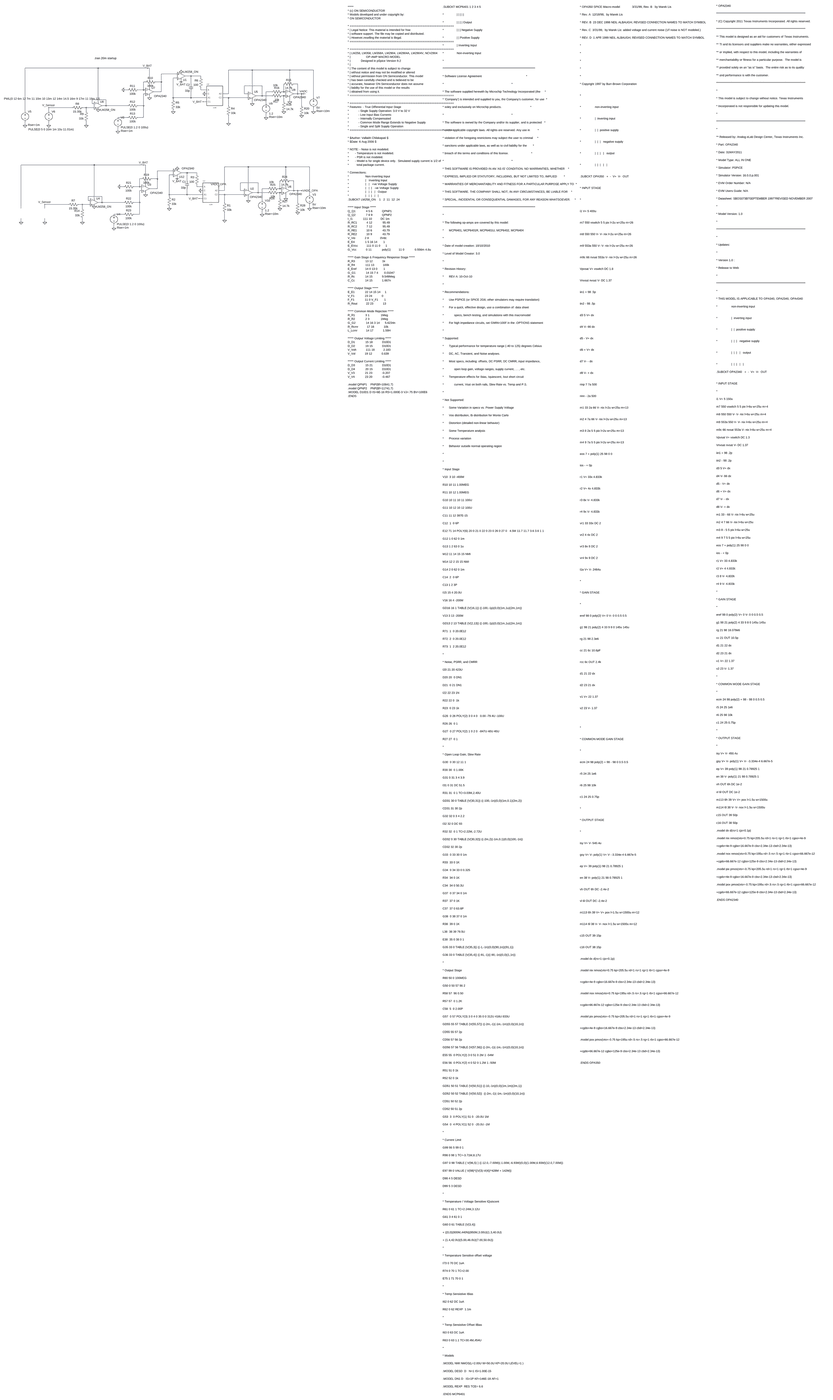
[diagram p0: schematic IL300_F-107_fuck.asc, whole sheet]
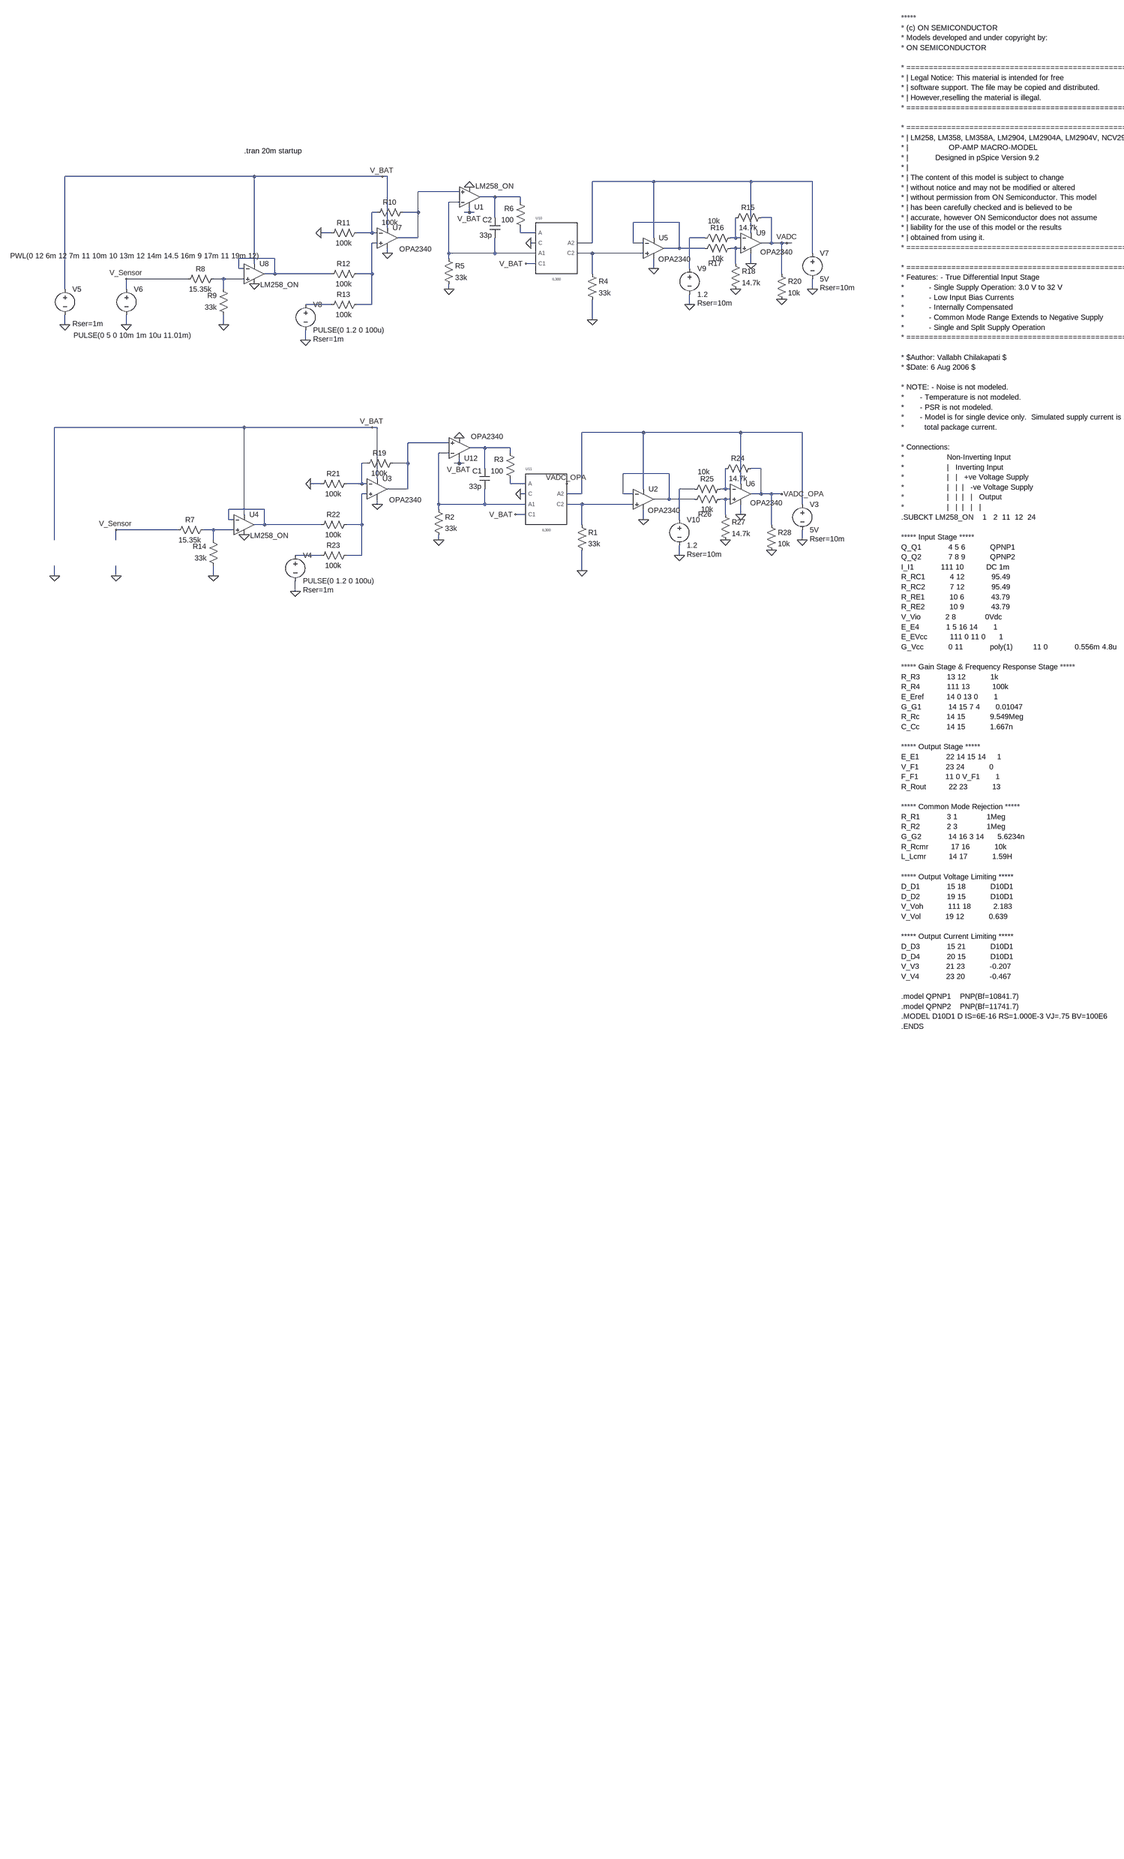
[diagram p1: schematic IL300_F-107_fuck.asc, part, row 1 of 2, column 1 of 2]
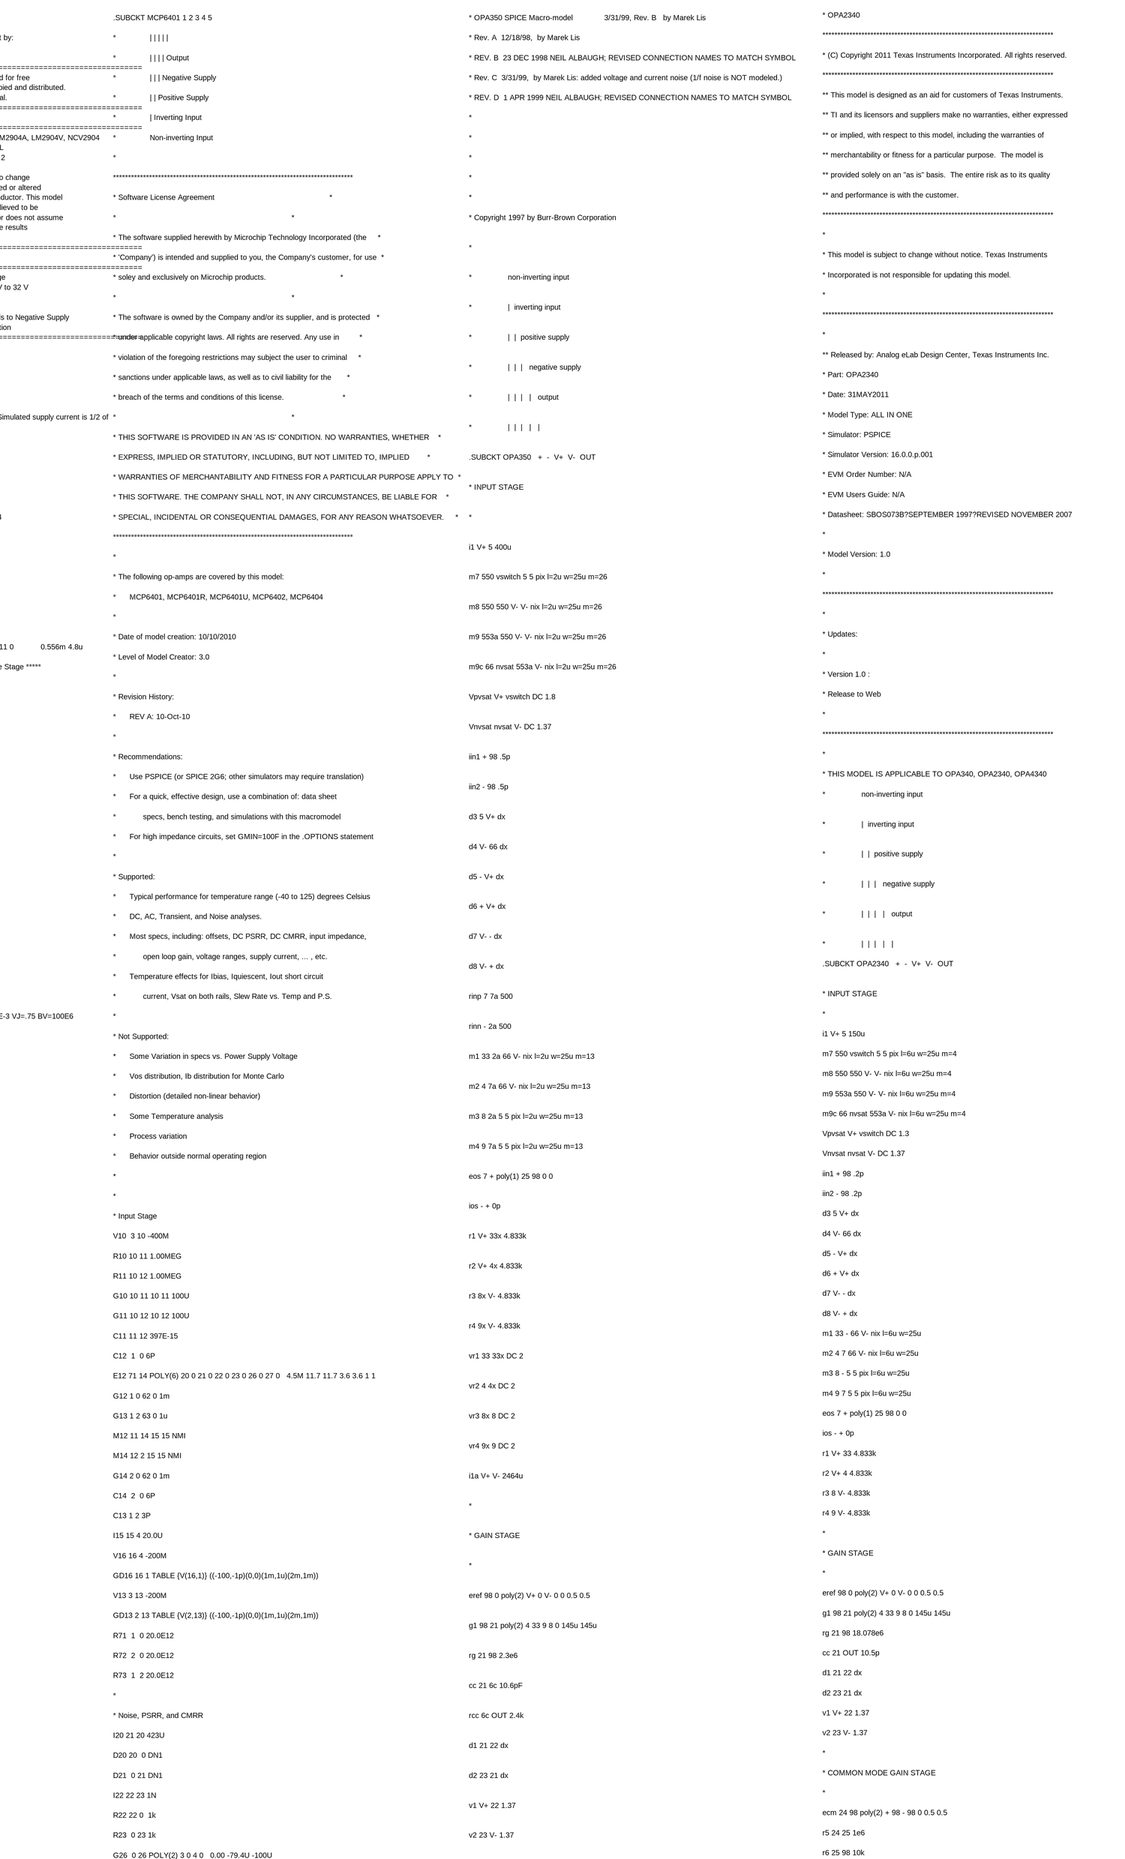
[diagram p2: schematic IL300_F-107_fuck.asc, part, row 1 of 2, column 2 of 2]
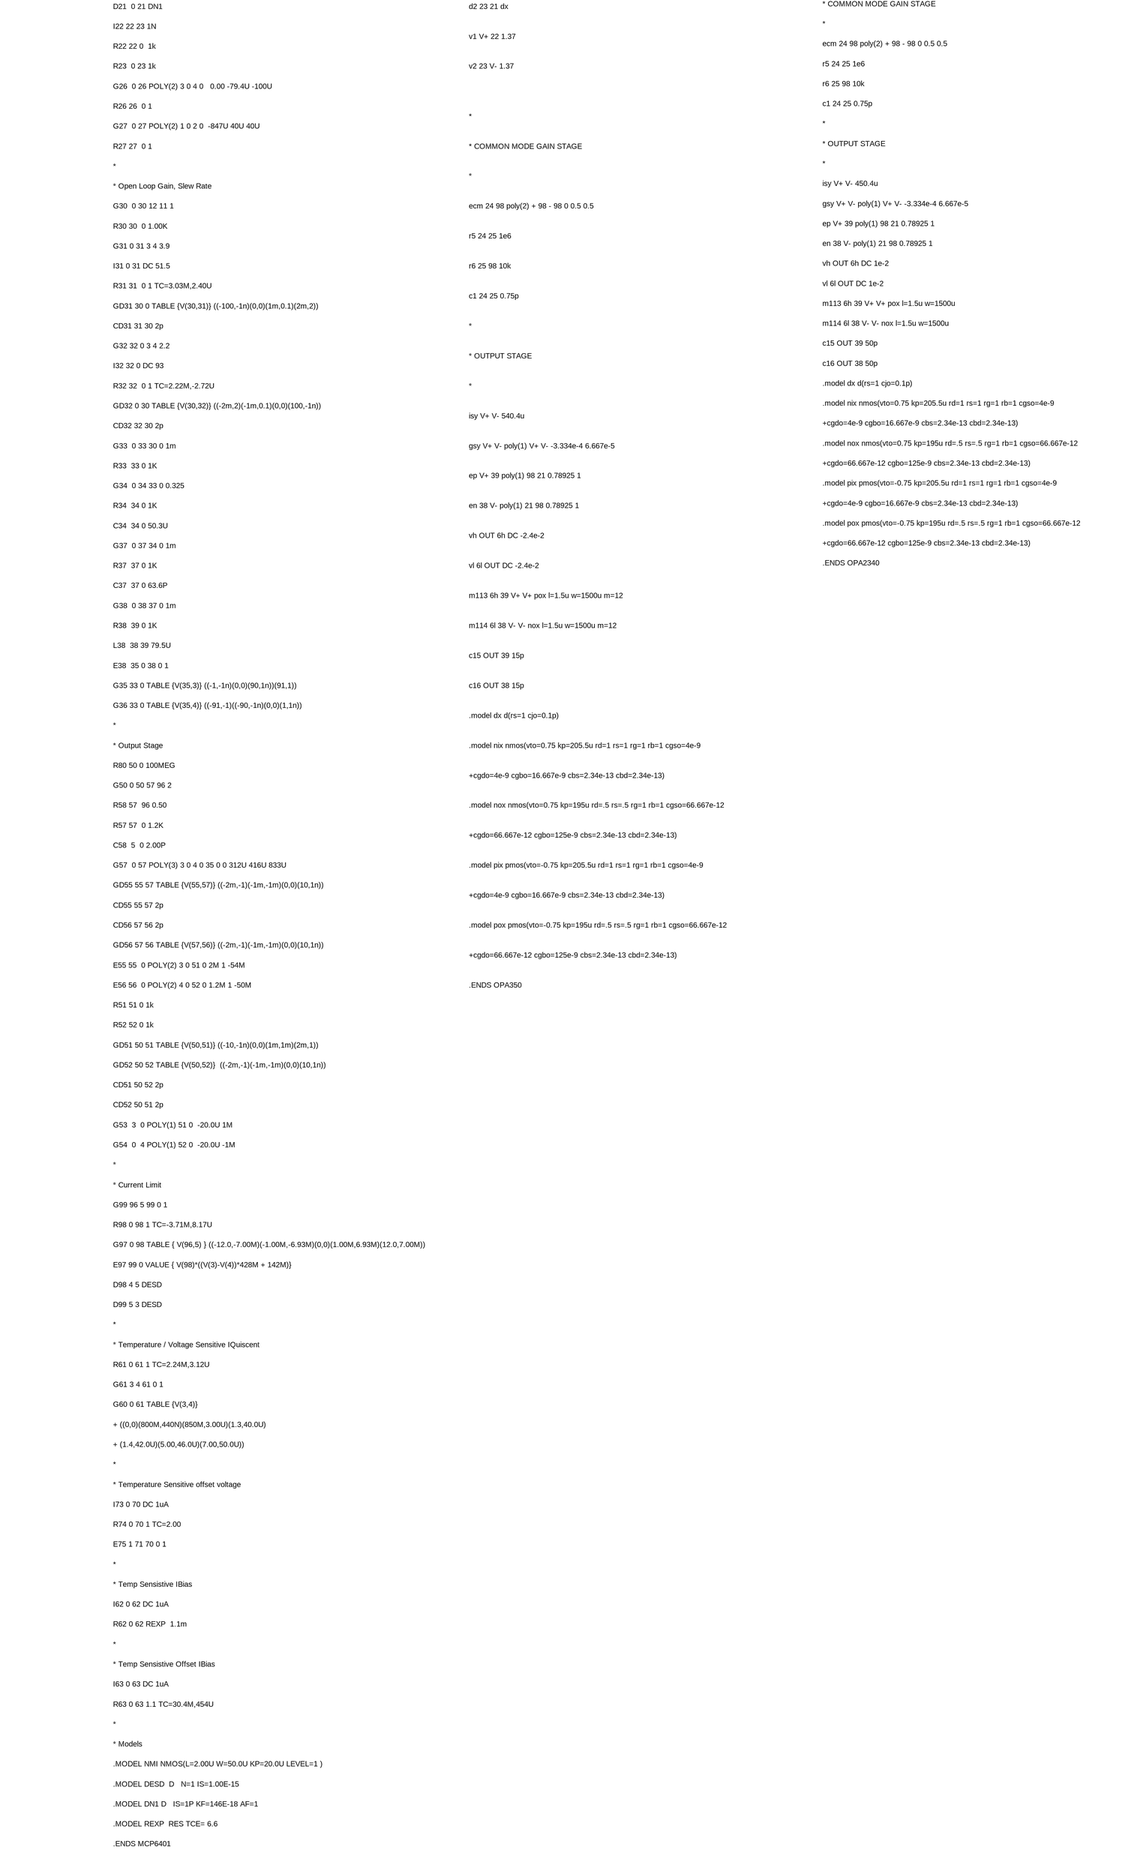
[diagram p3: schematic IL300_F-107_fuck.asc, part, row 2 of 2, column 2 of 2]
IL300_F-107_fuck.asc, the LTspice schematic file:
Version 4
SHEET 1 6832 5392
WIRE -976 -960 -1568 -960
WIRE -576 -960 -976 -960
WIRE -560 -960 -576 -960
WIRE 272 -944 80 -944
WIRE 576 -944 272 -944
WIRE 768 -944 576 -944
WIRE -336 -912 -464 -912
WIRE -224 -896 -272 -896
WIRE -144 -896 -224 -896
WIRE -336 -880 -368 -880
WIRE -144 -880 -144 -896
WIRE -592 -848 -608 -848
WIRE -464 -848 -464 -912
WIRE -464 -848 -512 -848
WIRE -304 -848 -304 -864
WIRE -304 -848 -320 -848
WIRE -288 -848 -304 -848
WIRE -224 -832 -224 -896
WIRE 640 -832 608 -832
WIRE 352 -816 208 -816
WIRE -560 -800 -560 -960
WIRE -736 -784 -768 -784
WIRE -608 -784 -608 -848
WIRE -608 -784 -656 -784
WIRE -592 -784 -608 -784
WIRE -144 -784 -144 -800
WIRE -96 -784 -144 -784
WIRE 576 -784 576 -944
WIRE -464 -768 -464 -848
WIRE -464 -768 -528 -768
WIRE 272 -768 272 -944
WIRE 432 -768 384 -768
WIRE 528 -768 528 -832
WIRE 528 -768 512 -768
WIRE 544 -768 528 -768
WIRE -592 -752 -608 -752
WIRE -96 -752 -112 -752
WIRE 80 -752 80 -944
WIRE 80 -752 32 -752
WIRE 208 -752 208 -816
WIRE 240 -752 208 -752
WIRE 640 -752 640 -832
WIRE 640 -752 608 -752
WIRE 672 -752 640 -752
WIRE 688 -752 672 -752
WIRE 704 -752 688 -752
WIRE 352 -736 352 -816
WIRE 352 -736 304 -736
WIRE 432 -736 352 -736
WIRE 528 -736 512 -736
WIRE 544 -736 528 -736
WIRE -560 -720 -560 -736
WIRE -368 -720 -368 -880
WIRE -224 -720 -224 -768
WIRE -224 -720 -368 -720
WIRE -96 -720 -224 -720
WIRE 80 -720 32 -720
WIRE 240 -720 80 -720
WIRE 768 -720 768 -944
WIRE -912 -704 -1024 -704
WIRE -368 -704 -368 -720
WIRE -976 -688 -976 -960
WIRE -96 -688 -128 -688
WIRE 528 -688 528 -736
WIRE 576 -688 576 -720
WIRE -1024 -672 -1024 -704
WIRE -1008 -672 -1024 -672
WIRE 272 -672 272 -704
WIRE 384 -672 384 -768
WIRE -912 -656 -912 -704
WIRE -912 -656 -944 -656
WIRE -736 -656 -912 -656
WIRE -608 -656 -608 -752
WIRE -608 -656 -656 -656
WIRE 80 -656 80 -720
WIRE 672 -656 672 -752
WIRE -1184 -640 -1376 -640
WIRE -1072 -640 -1104 -640
WIRE -1008 -640 -1072 -640
WIRE -1568 -608 -1568 -960
WIRE -1376 -608 -1376 -640
WIRE -1072 -608 -1072 -640
WIRE -368 -608 -368 -624
WIRE 768 -608 768 -640
WIRE -736 -560 -816 -560
WIRE -608 -560 -608 -656
WIRE -608 -560 -656 -560
WIRE 384 -560 384 -592
WIRE 80 -512 80 -576
WIRE -1568 -496 -1568 -528
WIRE -1376 -496 -1376 -528
WIRE -1072 -496 -1072 -528
WIRE -816 -448 -816 -480
WIRE -1008 -176 -1600 -176
WIRE -608 -176 -1008 -176
WIRE -592 -176 -608 -176
WIRE 240 -160 48 -160
WIRE 544 -160 240 -160
WIRE 736 -160 544 -160
WIRE -368 -128 -496 -128
WIRE -256 -112 -304 -112
WIRE -176 -112 -256 -112
WIRE -368 -96 -400 -96
WIRE -176 -96 -176 -112
WIRE -624 -64 -640 -64
WIRE -496 -64 -496 -128
WIRE -496 -64 -544 -64
WIRE -336 -64 -336 -80
WIRE -336 -64 -352 -64
WIRE -320 -64 -336 -64
WIRE -256 -48 -256 -112
WIRE 608 -48 576 -48
WIRE 320 -32 176 -32
WIRE -592 -16 -592 -176
WIRE -768 0 -800 0
WIRE -640 0 -640 -64
WIRE -640 0 -688 0
WIRE -624 0 -640 0
WIRE -176 0 -176 -16
WIRE -128 0 -176 0
WIRE 544 0 544 -160
WIRE -496 16 -496 -64
WIRE -496 16 -560 16
WIRE 240 16 240 -160
WIRE 400 16 352 16
WIRE 496 16 496 -48
WIRE 496 16 480 16
WIRE 512 16 496 16
WIRE -624 32 -640 32
WIRE -128 32 -144 32
WIRE 48 32 48 -160
WIRE 48 32 0 32
WIRE 176 32 176 -32
WIRE 208 32 176 32
WIRE 608 32 608 -48
WIRE 608 32 576 32
WIRE 640 32 608 32
WIRE 672 32 640 32
WIRE 320 48 320 -32
WIRE 320 48 272 48
WIRE 400 48 320 48
WIRE 496 48 480 48
WIRE 512 48 496 48
WIRE -592 64 -592 48
WIRE -400 64 -400 -96
WIRE -256 64 -256 16
WIRE -256 64 -400 64
WIRE -128 64 -256 64
WIRE 48 64 0 64
WIRE 208 64 48 64
WIRE 736 64 736 -160
WIRE -944 80 -1056 80
WIRE -400 80 -400 64
WIRE -1008 96 -1008 -176
WIRE -128 96 -160 96
WIRE 496 96 496 48
WIRE 544 96 544 64
WIRE -1056 112 -1056 80
WIRE -1040 112 -1056 112
WIRE 240 112 240 80
WIRE 352 112 352 16
WIRE -944 128 -944 80
WIRE -944 128 -976 128
WIRE -768 128 -944 128
WIRE -640 128 -640 32
WIRE -640 128 -688 128
WIRE 48 128 48 64
WIRE 640 128 640 32
WIRE -1216 144 -1408 144
WIRE -1104 144 -1136 144
WIRE -1040 144 -1104 144
WIRE -1600 176 -1600 -176
WIRE -1408 176 -1408 144
WIRE -1104 176 -1104 144
WIRE -400 176 -400 160
WIRE 736 176 736 144
WIRE -768 224 -848 224
WIRE -640 224 -640 128
WIRE -640 224 -688 224
WIRE 352 224 352 192
WIRE 48 272 48 208
WIRE -1600 288 -1600 256
WIRE -1408 288 -1408 256
WIRE -1104 288 -1104 256
WIRE -848 336 -848 304
FLAG -1376 -496 0
FLAG -1568 -496 0
FLAG 80 -512 0
FLAG -304 -928 0
FLAG -368 -608 0
FLAG -112 -752 0
FLAG 768 -608 0
FLAG 272 -672 0
FLAG -576 -960 V_BAT
FLAG -1376 -640 V_Sensor
FLAG -1072 -496 0
FLAG -976 -624 0
FLAG -560 -720 0
FLAG -768 -784 0
FLAG -816 -448 0
FLAG 576 -688 0
FLAG 384 -560 0
FLAG 528 -608 0
FLAG 688 -752 VADC
FLAG -128 -688 V_BAT
FLAG -304 -848 V_BAT
FLAG 672 -576 0
FLAG -1408 288 0
FLAG -1600 288 0
FLAG 48 272 0
FLAG -336 -144 0
FLAG -400 176 0
FLAG -144 32 0
FLAG 736 176 0
FLAG 240 112 0
FLAG -608 -176 V_BAT
FLAG -1408 144 V_Sensor
FLAG -1104 288 0
FLAG -1008 160 0
FLAG -592 64 0
FLAG -800 0 0
FLAG -848 336 0
FLAG 544 96 0
FLAG 352 224 0
FLAG 496 176 0
FLAG -160 96 V_BAT
FLAG -336 -64 V_BAT
FLAG 640 208 0
FLAG 672 32 VADC_OPA
FLAG 0 0 VADC_OPA
SYMBOL res 64 -672 R0
SYMATTR InstName R4
SYMATTR Value 33k
SYMBOL voltage -1568 -624 R0
WINDOW 123 0 0 Left 2
WINDOW 39 24 124 Left 2
WINDOW 3 -171 -88 Left 2
SYMATTR SpiceLine Rser=1m
SYMATTR Value PWL(0 12 6m 12 7m 11 10m 10 13m 12 14m 14.5 16m 9 17m 11 19m 12)
SYMATTR InstName V5
SYMBOL voltage -1376 -624 R0
WINDOW 123 0 0 Left 2
WINDOW 39 0 0 Left 2
WINDOW 3 -165 160 Left 2
SYMATTR Value PULSE(0 5 0 10m 1m 10u 11.01m)
SYMATTR InstName V6
SYMBOL res -384 -720 R0
SYMATTR InstName R5
SYMATTR Value 33k
SYMBOL res -128 -784 R180
WINDOW 0 36 76 Left 2
WINDOW 3 36 40 Left 2
SYMATTR InstName R6
SYMATTR Value 100
SYMBOL voltage 768 -736 R0
WINDOW 123 0 0 Left 2
WINDOW 39 24 124 Left 2
SYMATTR SpiceLine Rser=10m
SYMATTR InstName V7
SYMATTR Value 5V
SYMBOL Opamps\\opamp2 272 -800 R0
WINDOW 38 14 99 Left 2
SYMATTR SpiceModel OPA2340
SYMATTR InstName U5
SYMATTR Value ""
SYMBOL res -1088 -656 R90
WINDOW 0 0 56 VBottom 2
WINDOW 3 32 56 VTop 2
SYMATTR InstName R8
SYMATTR Value 15.35k
SYMBOL res -1056 -512 R180
WINDOW 0 36 76 Left 2
WINDOW 3 36 40 Left 2
SYMATTR InstName R9
SYMATTR Value 33k
SYMBOL Opamps\\opamp2 -560 -832 R0
WINDOW 38 37 99 Left 2
SYMATTR SpiceModel OPA2340
SYMATTR InstName U7
SYMATTR Value ""
SYMBOL res -496 -864 R90
WINDOW 0 0 56 VBottom 2
WINDOW 3 32 56 VTop 2
SYMATTR InstName R10
SYMATTR Value 100k
SYMBOL res -640 -800 R90
WINDOW 0 0 56 VBottom 2
WINDOW 3 32 56 VTop 2
SYMATTR InstName R11
SYMATTR Value 100k
SYMBOL res -640 -672 R90
WINDOW 0 0 56 VBottom 2
WINDOW 3 32 56 VTop 2
SYMATTR InstName R12
SYMATTR Value 100k
SYMBOL res -640 -576 R90
WINDOW 0 0 56 VBottom 2
WINDOW 3 32 56 VTop 2
SYMATTR InstName R13
SYMATTR Value 100k
SYMBOL voltage -816 -576 R0
WINDOW 123 0 0 Left 2
WINDOW 39 24 124 Left 2
SYMATTR SpiceLine Rser=1m
SYMATTR InstName V8
SYMATTR Value PULSE(0 1.2 0 100u)
SYMBOL Opamps\\opamp2 -976 -720 R0
WINDOW 38 19 98 Left 2
SYMATTR SpiceModel LM258_ON
SYMATTR InstName U8
SYMATTR Value ""
SYMBOL Opamps\\opamp2 576 -816 R0
WINDOW 38 29 92 Left 2
SYMATTR SpiceModel OPA2340
SYMATTR InstName U9
SYMATTR Value ""
SYMBOL res 512 -816 R270
WINDOW 0 32 56 VTop 2
WINDOW 3 0 56 VBottom 2
SYMATTR InstName R15
SYMATTR Value 14.7k
SYMBOL res 416 -752 R270
WINDOW 0 32 56 VTop 2
WINDOW 3 85 45 VBottom 2
SYMATTR InstName R16
SYMATTR Value 10k
SYMBOL res 416 -720 R270
WINDOW 0 -47 49 VTop 2
WINDOW 3 0 56 VBottom 2
SYMATTR InstName R17
SYMATTR Value 10k
SYMBOL res 512 -704 R0
SYMATTR InstName R18
SYMATTR Value 14.7k
SYMBOL voltage 384 -688 R0
WINDOW 123 0 0 Left 2
WINDOW 39 24 124 Left 2
SYMATTR SpiceLine Rser=10m
SYMATTR InstName V9
SYMATTR Value 1.2
SYMBOL IL300 -32 -736 R0
SYMATTR InstName U10
SYMBOL cap -208 -832 M0
SYMATTR InstName C2
SYMATTR Value 33p
SYMBOL res 656 -672 R0
SYMATTR InstName R20
SYMATTR Value 10k
SYMBOL Opamps\\opamp2 -304 -832 M180
WINDOW 38 19 98 Left 2
SYMATTR SpiceModel LM258_ON
SYMATTR InstName U1
SYMATTR Value ""
SYMBOL res 32 112 R0
SYMATTR InstName R1
SYMATTR Value 33k
SYMBOL res -416 64 R0
SYMATTR InstName R2
SYMATTR Value 33k
SYMBOL res -160 0 R180
WINDOW 0 36 76 Left 2
WINDOW 3 36 40 Left 2
SYMATTR InstName R3
SYMATTR Value 100
SYMBOL voltage 736 48 R0
WINDOW 123 0 0 Left 2
WINDOW 39 24 124 Left 2
SYMATTR SpiceLine Rser=10m
SYMATTR InstName V3
SYMATTR Value 5V
SYMBOL Opamps\\opamp2 240 -16 R0
WINDOW 38 14 99 Left 2
SYMATTR SpiceModel OPA2340
SYMATTR InstName U2
SYMATTR Value ""
SYMBOL res -1120 128 R90
WINDOW 0 0 56 VBottom 2
WINDOW 3 32 56 VTop 2
SYMATTR InstName R7
SYMATTR Value 15.35k
SYMBOL res -1088 272 R180
WINDOW 0 36 76 Left 2
WINDOW 3 36 40 Left 2
SYMATTR InstName R14
SYMATTR Value 33k
SYMBOL Opamps\\opamp2 -592 -48 R0
WINDOW 38 37 99 Left 2
SYMATTR SpiceModel OPA2340
SYMATTR InstName U3
SYMATTR Value ""
SYMBOL res -528 -80 R90
WINDOW 0 0 56 VBottom 2
WINDOW 3 32 56 VTop 2
SYMATTR InstName R19
SYMATTR Value 100k
SYMBOL res -672 -16 R90
WINDOW 0 0 56 VBottom 2
WINDOW 3 32 56 VTop 2
SYMATTR InstName R21
SYMATTR Value 100k
SYMBOL res -672 112 R90
WINDOW 0 0 56 VBottom 2
WINDOW 3 32 56 VTop 2
SYMATTR InstName R22
SYMATTR Value 100k
SYMBOL res -672 208 R90
WINDOW 0 0 56 VBottom 2
WINDOW 3 32 56 VTop 2
SYMATTR InstName R23
SYMATTR Value 100k
SYMBOL voltage -848 208 R0
WINDOW 123 0 0 Left 2
WINDOW 39 24 124 Left 2
SYMATTR SpiceLine Rser=1m
SYMATTR InstName V4
SYMATTR Value PULSE(0 1.2 0 100u)
SYMBOL Opamps\\opamp2 -1008 64 R0
WINDOW 38 19 98 Left 2
SYMATTR SpiceModel LM258_ON
SYMATTR InstName U4
SYMATTR Value ""
SYMBOL Opamps\\opamp2 544 -32 R0
WINDOW 38 29 92 Left 2
SYMATTR SpiceModel OPA2340
SYMATTR InstName U6
SYMATTR Value ""
SYMBOL res 480 -32 R270
WINDOW 0 32 56 VTop 2
WINDOW 3 0 56 VBottom 2
SYMATTR InstName R24
SYMATTR Value 14.7k
SYMBOL res 384 32 R270
WINDOW 0 32 56 VTop 2
WINDOW 3 85 45 VBottom 2
SYMATTR InstName R25
SYMATTR Value 10k
SYMBOL res 384 64 R270
WINDOW 0 -47 49 VTop 2
WINDOW 3 0 56 VBottom 2
SYMATTR InstName R26
SYMATTR Value 10k
SYMBOL res 480 80 R0
SYMATTR InstName R27
SYMATTR Value 14.7k
SYMBOL voltage 352 96 R0
WINDOW 123 0 0 Left 2
WINDOW 39 24 124 Left 2
SYMATTR SpiceLine Rser=10m
SYMATTR InstName V10
SYMATTR Value 1.2
SYMBOL IL300 -64 48 R0
SYMATTR InstName U11
SYMBOL cap -240 -48 M0
SYMATTR InstName C1
SYMATTR Value 33p
SYMBOL res 624 112 R0
SYMATTR InstName R28
SYMATTR Value 10k
SYMBOL Opamps\\opamp2 -336 -48 M180
WINDOW 38 37 99 Left 2
SYMATTR SpiceModel OPA2340
SYMATTR InstName U12
SYMATTR Value ""
TEXT 2648 -1456 Left 2 !.SUBCKT MCP6401 1 2 3 4 5\n\n*               | | | | |\n\n*               | | | | Output\n\n*               | | | Negative Supply\n\n*               | | Positive Supply\n\n*               | Inverting Input\n\n*               Non-inverting Input\n\n*\n\n********************************************************************************\n\n* Software License Agreement                                                   *\n\n*                                                                              *\n\n* The software supplied herewith by Microchip Technology Incorporated (the     *\n\n* 'Company') is intended and supplied to you, the Company's customer, for use  *\n\n* soley and exclusively on Microchip products.                                 *\n\n*                                                                              *\n\n* The software is owned by the Company and/or its supplier, and is protected   *\n\n* under applicable copyright laws. All rights are reserved. Any use in         *\n\n* violation of the foregoing restrictions may subject the user to criminal     *\n\n* sanctions under applicable laws, as well as to civil liability for the       *\n\n* breach of the terms and conditions of this license.                          *\n\n*                                                                              *\n\n* THIS SOFTWARE IS PROVIDED IN AN 'AS IS' CONDITION. NO WARRANTIES, WHETHER    *\n\n* EXPRESS, IMPLIED OR STATUTORY, INCLUDING, BUT NOT LIMITED TO, IMPLIED        *\n\n* WARRANTIES OF MERCHANTABILITY AND FITNESS FOR A PARTICULAR PURPOSE APPLY TO  *\n\n* THIS SOFTWARE. THE COMPANY SHALL NOT, IN ANY CIRCUMSTANCES, BE LIABLE FOR    *\n\n* SPECIAL, INCIDENTAL OR CONSEQUENTIAL DAMAGES, FOR ANY REASON WHATSOEVER.     *\n\n********************************************************************************\n\n*\n\n* The following op-amps are covered by this model:\n\n*      MCP6401, MCP6401R, MCP6401U, MCP6402, MCP6404\n\n*\n\n* Date of model creation: 10/10/2010\n\n* Level of Model Creator: 3.0\n\n*\n\n* Revision History:\n\n*      REV A: 10-Oct-10\n\n*       \n\n* Recommendations:\n\n*      Use PSPICE (or SPICE 2G6; other simulators may require translation)\n\n*      For a quick, effective design, use a combination of: data sheet\n\n*            specs, bench testing, and simulations with this macromodel\n\n*      For high impedance circuits, set GMIN=100F in the .OPTIONS statement\n\n*\n\n* Supported:\n\n*      Typical performance for temperature range (-40 to 125) degrees Celsius\n\n*      DC, AC, Transient, and Noise analyses.\n\n*      Most specs, including: offsets, DC PSRR, DC CMRR, input impedance,\n\n*            open loop gain, voltage ranges, supply current, ... , etc.\n\n*      Temperature effects for Ibias, Iquiescent, Iout short circuit \n\n*            current, Vsat on both rails, Slew Rate vs. Temp and P.S.\n\n*\n\n* Not Supported:\n\n*      Some Variation in specs vs. Power Supply Voltage\n\n*      Vos distribution, Ib distribution for Monte Carlo\n\n*      Distortion (detailed non-linear behavior)\n\n*      Some Temperature analysis\n\n*      Process variation\n\n*      Behavior outside normal operating region\n\n*\n\n*\n\n* Input Stage\n\nV10  3 10 -400M\n\nR10 10 11 1.00MEG\n\nR11 10 12 1.00MEG\n\nG10 10 11 10 11 100U\n\nG11 10 12 10 12 100U\n\nC11 11 12 397E-15\n\nC12  1  0 6P\n\nE12 71 14 POLY(6) 20 0 21 0 22 0 23 0 26 0 27 0   4.5M 11.7 11.7 3.6 3.6 1 1\n\nG12 1 0 62 0 1m\n\nG13 1 2 63 0 1u\n\nM12 11 14 15 15 NMI \n\nM14 12 2 15 15 NMI \n\nG14 2 0 62 0 1m\n\nC14  2  0 6P\n\nC13 1 2 3P\n\nI15 15 4 20.0U\n\nV16 16 4 -200M\n\nGD16 16 1 TABLE {V(16,1)} ((-100,-1p)(0,0)(1m,1u)(2m,1m)) \n\nV13 3 13 -200M\n\nGD13 2 13 TABLE {V(2,13)} ((-100,-1p)(0,0)(1m,1u)(2m,1m)) \n\nR71  1  0 20.0E12\n\nR72  2  0 20.0E12\n\nR73  1  2 20.0E12\n\n*\n\n* Noise, PSRR, and CMRR\n\nI20 21 20 423U\n\nD20 20  0 DN1\n\nD21  0 21 DN1\n\nI22 22 23 1N\n\nR22 22 0  1k\n\nR23  0 23 1k\n\nG26  0 26 POLY(2) 3 0 4 0   0.00 -79.4U -100U\n\nR26 26  0 1\n\nG27  0 27 POLY(2) 1 0 2 0  -847U 40U 40U\n\nR27 27  0 1\n\n*\n\n* Open Loop Gain, Slew Rate\n\nG30  0 30 12 11 1\n\nR30 30  0 1.00K\n\nG31 0 31 3 4 3.9\n\nI31 0 31 DC 51.5\n\nR31 31  0 1 TC=3.03M,2.40U\n\nGD31 30 0 TABLE {V(30,31)} ((-100,-1n)(0,0)(1m,0.1)(2m,2))\n\nCD31 31 30 2p\n\nG32 32 0 3 4 2.2\n\nI32 32 0 DC 93\n\nR32 32  0 1 TC=2.22M,-2.72U\n\nGD32 0 30 TABLE {V(30,32)} ((-2m,2)(-1m,0.1)(0,0)(100,-1n))\n\nCD32 32 30 2p\n\nG33  0 33 30 0 1m\n\nR33  33 0 1K\n\nG34  0 34 33 0 0.325\n\nR34  34 0 1K\n\nC34  34 0 50.3U\n\nG37  0 37 34 0 1m\n\nR37  37 0 1K\n\nC37  37 0 63.6P\n\nG38  0 38 37 0 1m\n\nR38  39 0 1K\n\nL38  38 39 79.5U\n\nE38  35 0 38 0 1\n\nG35 33 0 TABLE {V(35,3)} ((-1,-1n)(0,0)(90,1n))(91,1))\n\nG36 33 0 TABLE {V(35,4)} ((-91,-1)((-90,-1n)(0,0)(1,1n))\n\n*\n\n* Output Stage\n\nR80 50 0 100MEG\n\nG50 0 50 57 96 2\n\nR58 57  96 0.50\n\nR57 57  0 1.2K\n\nC58  5  0 2.00P\n\nG57  0 57 POLY(3) 3 0 4 0 35 0 0 312U 416U 833U\n\nGD55 55 57 TABLE {V(55,57)} ((-2m,-1)(-1m,-1m)(0,0)(10,1n))\n\nCD55 55 57 2p\n\nCD56 57 56 2p\n\nGD56 57 56 TABLE {V(57,56)} ((-2m,-1)(-1m,-1m)(0,0)(10,1n))\n\nE55 55  0 POLY(2) 3 0 51 0 2M 1 -54M \n\nE56 56  0 POLY(2) 4 0 52 0 1.2M 1 -50M \n\nR51 51 0 1k\n\nR52 52 0 1k\n\nGD51 50 51 TABLE {V(50,51)} ((-10,-1n)(0,0)(1m,1m)(2m,1))\n\nGD52 50 52 TABLE {V(50,52)}  ((-2m,-1)(-1m,-1m)(0,0)(10,1n))\n\nCD51 50 52 2p\n\nCD52 50 51 2p\n\nG53  3  0 POLY(1) 51 0  -20.0U 1M\n\nG54  0  4 POLY(1) 52 0  -20.0U -1M\n\n*\n\n* Current Limit\n\nG99 96 5 99 0 1\n\nR98 0 98 1 TC=-3.71M,8.17U\n\nG97 0 98 TABLE { V(96,5) } ((-12.0,-7.00M)(-1.00M,-6.93M)(0,0)(1.00M,6.93M)(12.0,7.00M))\n\nE97 99 0 VALUE { V(98)*((V(3)-V(4))*428M + 142M)}\n\nD98 4 5 DESD\n\nD99 5 3 DESD\n\n*\n\n* Temperature / Voltage Sensitive IQuiscent\n\nR61 0 61 1 TC=2.24M,3.12U\n\nG61 3 4 61 0 1\n\nG60 0 61 TABLE {V(3,4)} \n\n+ ((0,0)(800M,440N)(850M,3.00U)(1.3,40.0U)\n\n+ (1.4,42.0U)(5.00,46.0U)(7.00,50.0U))\n\n*\n\n* Temperature Sensitive offset voltage\n\nI73 0 70 DC 1uA\n\nR74 0 70 1 TC=2.00\n\nE75 1 71 70 0 1 \n\n*\n\n* Temp Sensistive IBias\n\nI62 0 62 DC 1uA\n\nR62 0 62 REXP  1.1m\n\n*\n\n* Temp Sensistive Offset IBias\n\nI63 0 63 DC 1uA\n\nR63 0 63 1.1 TC=30.4M,454U\n\n*\n\n* Models\n\n.MODEL NMI NMOS(L=2.00U W=50.0U KP=20.0U LEVEL=1 )\n\n.MODEL DESD  D   N=1 IS=1.00E-15\n\n.MODEL DN1 D   IS=1P KF=146E-18 AF=1\n\n.MODEL REXP  RES TCE= 6.6\n\n.ENDS MCP6401
TEXT 1880 -1456 Left 2 !*****\n* (c) ON SEMICONDUCTOR\n* Models developed and under copyright by:\n* ON SEMICONDUCTOR \n \n* ============================================================\n* | Legal Notice: This material is intended for free  \n* | software support. The file may be copied and distributed. \n* | However,reselling the material is illegal.\n* ============================================================\n \n* ============================================================      \n* | LM258, LM358, LM358A, LM2904, LM2904A, LM2904V, NCV2904\n* |                  OP-AMP MACRO-MODEL\n* |            Designed in pSpice Version 9.2\n* |\n* | The content of this model is subject to change\n* | without notice and may not be modified or altered\n* | without permission from ON Semiconductor. This model\n* | has been carefully checked and is believed to be\n* | accurate, however ON Semiconductor does not assume \n* | liability for the use of this model or the results \n* | obtained from using it.\n* ============================================================\n \n* ============================================================\n* Features: - True Differential Input Stage\n*           - Single Supply Operation: 3.0 V to 32 V\n*           - Low Input Bias Currents\n*           - Internally Compensated\n*           - Common Mode Range Extends to Negative Supply\n*           - Single and Split Supply Operation\n* ============================================================\n \n* $Author: Vallabh Chilakapati $\n* $Date: 6 Aug 2006 $\n \n* NOTE: - Noise is not modeled.\n*       - Temperature is not modeled.\n*       - PSR is not modeled.\n*       - Model is for single device only.  Simulated supply current is 1/2 of\n*         total package current.\n \n* Connections:\n*                   Non-Inverting Input\n*                   |   Inverting Input\n*                   |   |   +ve Voltage Supply\n*                   |   |  |   -ve Voltage Supply\n*                   |   |  |   |   Output\n*                   |   |  |   |   |\n.SUBCKT LM258_ON    1   2  11  12  24\n \n***** Input Stage *****\nQ_Q1            4 5 6           QPNP1    \nQ_Q2            7 8 9           QPNP2\nI_I1            111 10          DC 1m\nR_RC1           4 12            95.49 \nR_RC2           7 12            95.49\nR_RE1           10 6            43.79 \nR_RE2           10 9            43.79\nV_Vio           2 8             0Vdc\nE_E4            1 5 16 14       1\nE_EVcc          111 0 11 0      1\nG_Vcc           0 11            poly(1)         11 0            0.556m 4.8u\n \n***** Gain Stage & Frequency Response Stage *****\nR_R3            13 12           1k  \nR_R4            111 13          100k  \nE_Eref          14 0 13 0       1\nG_G1            14 15 7 4       0.01047\nR_Rc            14 15           9.549Meg \nC_Cc            14 15           1.667n \n \n***** Output Stage *****\nE_E1            22 14 15 14     1\nV_F1            23 24           0\nF_F1            11 0 V_F1       1\nR_Rout          22 23           13\n \n***** Common Mode Rejection *****\nR_R1            3 1             1Meg\nR_R2            2 3             1Meg\nG_G2            14 16 3 14      5.6234n\nR_Rcmr          17 16           10k\nL_Lcmr          14 17           1.59H \n \n***** Output Voltage Limiting *****\nD_D1            15 18           D10D1\nD_D2            19 15           D10D1 \nV_Voh           111 18          2.183\nV_Vol           19 12           0.639\n \n***** Output Current Limiting *****\nD_D3            15 21           D10D1 \nD_D4            20 15           D10D1 \nV_V3            21 23           -0.207\nV_V4            23 20           -0.467\n \n.model QPNP1    PNP(Bf=10841.7)\n.model QPNP2    PNP(Bf=11741.7)\n.MODEL D10D1 D IS=6E-16 RS=1.000E-3 VJ=.75 BV=100E6\n.ENDS
TEXT 3760 -1456 Left 2 !* OPA350 SPICE Macro-model              3/31/99, Rev. B   by Marek Lis\n\n* Rev. A  12/18/98,  by Marek Lis\n\n* REV. B  23 DEC 1998 NEIL ALBAUGH; REVISED CONNECTION NAMES TO MATCH SYMBOL\n\n* Rev. C  3/31/99,  by Marek Lis: added voltage and current noise (1/f noise is NOT modeled.)\n\n* REV. D  1 APR 1999 NEIL ALBAUGH; REVISED CONNECTION NAMES TO MATCH SYMBOL\n\n*\n\n*\n\n*\n\n*\n\n*\n\n* Copyright 1997 by Burr-Brown Corporation\n\n\n*\n\n\n*                non-inverting input\n\n\n*                |  inverting input\n\n\n*                |  |  positive supply\n\n\n*                |  |  |   negative supply\n\n\n*                |  |  |   |   output\n\n\n*                |  |  |   |   |\n\n\n.SUBCKT OPA350   +  -  V+  V-  OUT\n\n\n* INPUT STAGE\n\n\n*\n\n\ni1 V+ 5 400u\n\n\nm7 550 vswitch 5 5 pix l=2u w=25u m=26\n\n\nm8 550 550 V- V- nix l=2u w=25u m=26\n\n\nm9 553a 550 V- V- nix l=2u w=25u m=26\n\n\nm9c 66 nvsat 553a V- nix l=2u w=25u m=26\n\n\nVpvsat V+ vswitch DC 1.8\n\n\nVnvsat nvsat V- DC 1.37\n\n\niin1 + 98 .5p\n\n\niin2 - 98 .5p\n\n\nd3 5 V+ dx\n\n\nd4 V- 66 dx\n\n\nd5 - V+ dx\n\n\nd6 + V+ dx\n\n\nd7 V- - dx\n\n\nd8 V- + dx\n\n\nrinp 7 7a 500\n\n\nrinn - 2a 500\n\n\nm1 33 2a 66 V- nix l=2u w=25u m=13\n\n\nm2 4 7a 66 V- nix l=2u w=25u m=13\n\n\nm3 8 2a 5 5 pix l=2u w=25u m=13\n\n\nm4 9 7a 5 5 pix l=2u w=25u m=13\n\n\neos 7 + poly(1) 25 98 0 0\n\n\nios - + 0p\n\n\nr1 V+ 33x 4.833k\n\n\nr2 V+ 4x 4.833k\n\n\nr3 8x V- 4.833k\n\n\nr4 9x V- 4.833k\n\n\nvr1 33 33x DC 2\n\n\nvr2 4 4x DC 2\n\n\nvr3 8x 8 DC 2\n\n\nvr4 9x 9 DC 2\n\n\ni1a V+ V- 2464u\n\n\n*\n\n\n* GAIN STAGE\n\n\n*\n\n\neref 98 0 poly(2) V+ 0 V- 0 0 0.5 0.5\n\n\ng1 98 21 poly(2) 4 33 9 8 0 145u 145u\n\n\nrg 21 98 2.3e6\n\n\ncc 21 6c 10.6pF\n\n\nrcc 6c OUT 2.4k\n\n\nd1 21 22 dx\n\n\nd2 23 21 dx\n\n\nv1 V+ 22 1.37\n\n\nv2 23 V- 1.37\n\n\n\n\n*\n\n\n* COMMON MODE GAIN STAGE\n\n\n*\n\n\necm 24 98 poly(2) + 98 - 98 0 0.5 0.5\n\n\nr5 24 25 1e6\n\n\nr6 25 98 10k\n\n\nc1 24 25 0.75p\n\n\n*\n\n\n* OUTPUT STAGE\n\n\n*\n\n\nisy V+ V- 540.4u\n\n\ngsy V+ V- poly(1) V+ V- -3.334e-4 6.667e-5\n\n\nep V+ 39 poly(1) 98 21 0.78925 1\n\n\nen 38 V- poly(1) 21 98 0.78925 1\n\n\nvh OUT 6h DC -2.4e-2\n\n\nvl 6l OUT DC -2.4e-2 \n\n\nm113 6h 39 V+ V+ pox l=1.5u w=1500u m=12\n\n\nm114 6l 38 V- V- nox l=1.5u w=1500u m=12\n\n\nc15 OUT 39 15p\n\n\nc16 OUT 38 15p\n\n\n.model dx d(rs=1 cjo=0.1p)\n\n\n.model nix nmos(vto=0.75 kp=205.5u rd=1 rs=1 rg=1 rb=1 cgso=4e-9\n\n\n+cgdo=4e-9 cgbo=16.667e-9 cbs=2.34e-13 cbd=2.34e-13)\n\n\n.model nox nmos(vto=0.75 kp=195u rd=.5 rs=.5 rg=1 rb=1 cgso=66.667e-12\n\n\n+cgdo=66.667e-12 cgbo=125e-9 cbs=2.34e-13 cbd=2.34e-13)\n\n\n.model pix pmos(vto=-0.75 kp=205.5u rd=1 rs=1 rg=1 rb=1 cgso=4e-9\n\n\n+cgdo=4e-9 cgbo=16.667e-9 cbs=2.34e-13 cbd=2.34e-13)\n\n\n.model pox pmos(vto=-0.75 kp=195u rd=.5 rs=.5 rg=1 rb=1 cgso=66.667e-12\n\n\n+cgdo=66.667e-12 cgbo=125e-9 cbs=2.34e-13 cbd=2.34e-13)\n\n\n.ENDS OPA350
TEXT 4864 -1464 Left 2 !* OPA2340\n\n*****************************************************************************\n\n* (C) Copyright 2011 Texas Instruments Incorporated. All rights reserved.                                            \n\n*****************************************************************************\n\n** This model is designed as an aid for customers of Texas Instruments.\n\n** TI and its licensors and suppliers make no warranties, either expressed\n\n** or implied, with respect to this model, including the warranties of \n\n** merchantability or fitness for a particular purpose.  The model is\n\n** provided solely on an "as is" basis.  The entire risk as to its quality\n\n** and performance is with the customer.\n\n*****************************************************************************\n\n*\n\n* This model is subject to change without notice. Texas Instruments\n\n* Incorporated is not responsible for updating this model.\n\n*\n\n*****************************************************************************\n\n*\n\n** Released by: Analog eLab Design Center, Texas Instruments Inc.\n\n* Part: OPA2340\n\n* Date: 31MAY2011\n\n* Model Type: ALL IN ONE\n\n* Simulator: PSPICE\n\n* Simulator Version: 16.0.0.p.001\n\n* EVM Order Number: N/A\n\n* EVM Users Guide: N/A\n\n* Datasheet: SBOS073B?SEPTEMBER 1997?REVISED NOVEMBER 2007\n\n*\n\n* Model Version: 1.0\n\n*\n\n*****************************************************************************\n\n*\n\n* Updates:\n\n*\n\n* Version 1.0 : \n\n* Release to Web\n\n*\n\n*****************************************************************************\n\n*\n\n* THIS MODEL IS APPLICABLE TO OPA340, OPA2340, OPA4340\n\n*                non-inverting input\n\n\n*                |  inverting input\n\n\n*                |  |  positive supply\n\n\n*                |  |  |   negative supply\n\n\n*                |  |  |   |   output\n\n\n*                |  |  |   |   |\n\n.SUBCKT OPA2340   +  -  V+  V-  OUT\n\n\n* INPUT STAGE\n\n*\n\ni1 V+ 5 150u\n\nm7 550 vswitch 5 5 pix l=6u w=25u m=4\n\nm8 550 550 V- V- nix l=6u w=25u m=4\n\nm9 553a 550 V- V- nix l=6u w=25u m=4\n\nm9c 66 nvsat 553a V- nix l=6u w=25u m=4\n\nVpvsat V+ vswitch DC 1.3\n\nVnvsat nvsat V- DC 1.37\n\niin1 + 98 .2p\n\niin2 - 98 .2p\n\nd3 5 V+ dx\n\nd4 V- 66 dx\n\nd5 - V+ dx\n\nd6 + V+ dx\n\nd7 V- - dx\n\nd8 V- + dx\n\nm1 33 - 66 V- nix l=6u w=25u\n\nm2 4 7 66 V- nix l=6u w=25u\n\nm3 8 - 5 5 pix l=6u w=25u\n\nm4 9 7 5 5 pix l=6u w=25u\n\neos 7 + poly(1) 25 98 0 0\n\nios - + 0p\n\nr1 V+ 33 4.833k\n\nr2 V+ 4 4.833k\n\nr3 8 V- 4.833k\n\nr4 9 V- 4.833k\n\n*\n\n* GAIN STAGE\n\n*\n\neref 98 0 poly(2) V+ 0 V- 0 0 0.5 0.5\n\ng1 98 21 poly(2) 4 33 9 8 0 145u 145u\n\nrg 21 98 18.078e6\n\ncc 21 OUT 10.5p\n\nd1 21 22 dx\n\nd2 23 21 dx\n\nv1 V+ 22 1.37\n\nv2 23 V- 1.37\n\n*\n\n* COMMON MODE GAIN STAGE\n\n*\n\necm 24 98 poly(2) + 98 - 98 0 0.5 0.5\n\nr5 24 25 1e6\n\nr6 25 98 10k\n\nc1 24 25 0.75p\n\n*\n\n* OUTPUT STAGE\n\n*\n\nisy V+ V- 450.4u\n\ngsy V+ V- poly(1) V+ V- -3.334e-4 6.667e-5\n\nep V+ 39 poly(1) 98 21 0.78925 1\n\nen 38 V- poly(1) 21 98 0.78925 1\n\nvh OUT 6h DC 1e-2\n\nvl 6l OUT DC 1e-2 \n\nm113 6h 39 V+ V+ pox l=1.5u w=1500u\n\nm114 6l 38 V- V- nox l=1.5u w=1500u\n\nc15 OUT 39 50p\n\nc16 OUT 38 50p\n\n.model dx d(rs=1 cjo=0.1p)\n\n.model nix nmos(vto=0.75 kp=205.5u rd=1 rs=1 rg=1 rb=1 cgso=4e-9\n\n+cgdo=4e-9 cgbo=16.667e-9 cbs=2.34e-13 cbd=2.34e-13)\n\n.model nox nmos(vto=0.75 kp=195u rd=.5 rs=.5 rg=1 rb=1 cgso=66.667e-12\n\n+cgdo=66.667e-12 cgbo=125e-9 cbs=2.34e-13 cbd=2.34e-13)\n\n.model pix pmos(vto=-0.75 kp=205.5u rd=1 rs=1 rg=1 rb=1 cgso=4e-9\n\n+cgdo=4e-9 cgbo=16.667e-9 cbs=2.34e-13 cbd=2.34e-13)\n\n.model pox pmos(vto=-0.75 kp=195u rd=.5 rs=.5 rg=1 rb=1 cgso=66.667e-12\n\n+cgdo=66.667e-12 cgbo=125e-9 cbs=2.34e-13 cbd=2.34e-13)\n\n.ENDS OPA2340
TEXT -1008 -1040 Left 2 !.tran 20m startup

The netlist it stands for:
* IL300_F-107_fuck.asc
R4 N012 0 33k
V5 V_BAT 0 PWL(0 12 6m 12 7m 11 10m 10 13m 12 14m 14.5 16m 9 17m 11 19m 12) Rser=1m
V6 V_Sensor 0 PULSE(0 5 0 10m 1m 10u 11.01m)
R5 N004 0 33k
R6 N007 N003 100
V7 N001 0 5V Rser=10m
XU5 N012 N006 N001 0 N006 OPA2340  ; pins In+ In- V+ V- OUT
R8 N014 V_Sensor 15.35k
R9 0 N014 33k
XU7 N010 N005 V_BAT 0 N002 OPA2340  ; pins In+ In- V+ V- OUT
R10 N002 N005 100k
R11 N005 0 100k
R12 N010 N013 100k
R13 N010 N015 100k
V8 N015 0 PULSE(0 1.2 0 100u) Rser=1m
XU8 N014 N013 V_BAT 0 N013 LM258_ON  ; pins In+ In- V+ V- OUT
XU9 N011 N009 N001 0 VADC OPA2340  ; pins In+ In- V+ V- OUT
R15 N009 VADC 14.7k
R16 N008 N009 10k
R17 N006 N011 10k
R18 N011 0 14.7k
V9 N008 0 1.2 Rser=10m
XU10 N007 0 N004 V_BAT N001 N012 IL300 IL300  ; pins A C A1 C1 A2 C2
C2 N003 N004 33p
R20 VADC 0 10k
XU1 N002 N004 V_BAT 0 N003 LM258_ON  ; pins In+ In- V+ V- OUT
R1 N027 0 33k
R2 N019 0 33k
R3 N022 N018 100
V3 N016 0 5V Rser=10m
XU2 N027 N021 N016 0 N021 OPA2340  ; pins In+ In- V+ V- OUT
R7 N029 V_Sensor 15.35k
R14 0 N029 33k
XU3 N025 N020 V_BAT 0 N017 OPA2340  ; pins In+ In- V+ V- OUT
R19 N017 N020 100k
R21 N020 0 100k
R22 N025 N028 100k
R23 N025 N030 100k
V4 N030 0 PULSE(0 1.2 0 100u) Rser=1m
XU4 N029 N028 V_BAT 0 N028 LM258_ON  ; pins In+ In- V+ V- OUT
XU6 N026 N024 N016 0 VADC_OPA OPA2340  ; pins In+ In- V+ V- OUT
R24 N024 VADC_OPA 14.7k
R25 N023 N024 10k
R26 N021 N026 10k
R27 N026 0 14.7k
V10 N023 0 1.2 Rser=10m
XU11 N022 0 N019 V_BAT N016 N027 IL300 IL300  ; pins A C A1 C1 A2 C2
C1 N018 N019 33p
R28 VADC_OPA 0 10k
XU12 N017 N019 V_BAT 0 N018 OPA2340  ; pins In+ In- V+ V- OUT
.SUBCKT MCP6401 1 2 3 4 5
*               | | | | |
*               | | | | Output
*               | | | Negative Supply
*               | | Positive Supply
*               | Inverting Input
*               Non-inverting Input
*
********************************************************************************
* Software License Agreement                                                   *
*                                                                              *
* The software supplied herewith by Microchip Technology Incorporated (the     *
* 'Company') is intended and supplied to you, the Company's customer, for use  *
* soley and exclusively on Microchip products.                                 *
*                                                                              *
* The software is owned by the Company and/or its supplier, and is protected   *
* under applicable copyright laws. All rights are reserved. Any use in         *
* violation of the foregoing restrictions may subject the user to criminal     *
* sanctions under applicable laws, as well as to civil liability for the       *
* breach of the terms and conditions of this license.                          *
*                                                                              *
* THIS SOFTWARE IS PROVIDED IN AN 'AS IS' CONDITION. NO WARRANTIES, WHETHER    *
* EXPRESS, IMPLIED OR STATUTORY, INCLUDING, BUT NOT LIMITED TO, IMPLIED        *
* WARRANTIES OF MERCHANTABILITY AND FITNESS FOR A PARTICULAR PURPOSE APPLY TO  *
* THIS SOFTWARE. THE COMPANY SHALL NOT, IN ANY CIRCUMSTANCES, BE LIABLE FOR    *
* SPECIAL, INCIDENTAL OR CONSEQUENTIAL DAMAGES, FOR ANY REASON WHATSOEVER.     *
********************************************************************************
*
* The following op-amps are covered by this model:
*      MCP6401, MCP6401R, MCP6401U, MCP6402, MCP6404
*
* Date of model creation: 10/10/2010
* Level of Model Creator: 3.0
*
* Revision History:
*      REV A: 10-Oct-10
*
* Recommendations:
*      Use PSPICE (or SPICE 2G6; other simulators may require translation)
*      For a quick, effective design, use a combination of: data sheet
*            specs, bench testing, and simulations with this macromodel
*      For high impedance circuits, set GMIN=100F in the .OPTIONS statement
*
* Supported:
*      Typical performance for temperature range (-40 to 125) degrees Celsius
*      DC, AC, Transient, and Noise analyses.
*      Most specs, including: offsets, DC PSRR, DC CMRR, input impedance,
*            open loop gain, voltage ranges, supply current, ... , etc.
*      Temperature effects for Ibias, Iquiescent, Iout short circuit
*            current, Vsat on both rails, Slew Rate vs. Temp and P.S.
*
* Not Supported:
*      Some Variation in specs vs. Power Supply Voltage
*      Vos distribution, Ib distribution for Monte Carlo
*      Distortion (detailed non-linear behavior)
*      Some Temperature analysis
*      Process variation
*      Behavior outside normal operating region
*
*
* Input Stage
V10  3 10 -400M
R10 10 11 1.00MEG
R11 10 12 1.00MEG
G10 10 11 10 11 100U
G11 10 12 10 12 100U
C11 11 12 397E-15
C12  1  0 6P
E12 71 14 POLY(6) 20 0 21 0 22 0 23 0 26 0 27 0   4.5M 11.7 11.7 3.6 3.6 1 1
G12 1 0 62 0 1m
G13 1 2 63 0 1u
M12 11 14 15 15 NMI
M14 12 2 15 15 NMI
G14 2 0 62 0 1m
C14  2  0 6P
C13 1 2 3P
I15 15 4 20.0U
V16 16 4 -200M
GD16 16 1 TABLE {V(16,1)} ((-100,-1p)(0,0)(1m,1u)(2m,1m))
V13 3 13 -200M
GD13 2 13 TABLE {V(2,13)} ((-100,-1p)(0,0)(1m,1u)(2m,1m))
R71  1  0 20.0E12
R72  2  0 20.0E12
R73  1  2 20.0E12
*
* Noise, PSRR, and CMRR
I20 21 20 423U
D20 20  0 DN1
D21  0 21 DN1
I22 22 23 1N
R22 22 0  1k
R23  0 23 1k
G26  0 26 POLY(2) 3 0 4 0   0.00 -79.4U -100U
R26 26  0 1
G27  0 27 POLY(2) 1 0 2 0  -847U 40U 40U
R27 27  0 1
*
* Open Loop Gain, Slew Rate
G30  0 30 12 11 1
R30 30  0 1.00K
G31 0 31 3 4 3.9
I31 0 31 DC 51.5
R31 31  0 1 TC=3.03M,2.40U
GD31 30 0 TABLE {V(30,31)} ((-100,-1n)(0,0)(1m,0.1)(2m,2))
CD31 31 30 2p
G32 32 0 3 4 2.2
I32 32 0 DC 93
R32 32  0 1 TC=2.22M,-2.72U
GD32 0 30 TABLE {V(30,32)} ((-2m,2)(-1m,0.1)(0,0)(100,-1n))
CD32 32 30 2p
G33  0 33 30 0 1m
R33  33 0 1K
G34  0 34 33 0 0.325
R34  34 0 1K
C34  34 0 50.3U
G37  0 37 34 0 1m
R37  37 0 1K
C37  37 0 63.6P
G38  0 38 37 0 1m
R38  39 0 1K
L38  38 39 79.5U
E38  35 0 38 0 1
G35 33 0 TABLE {V(35,3)} ((-1,-1n)(0,0)(90,1n))(91,1))
G36 33 0 TABLE {V(35,4)} ((-91,-1)((-90,-1n)(0,0)(1,1n))
*
* Output Stage
R80 50 0 100MEG
G50 0 50 57 96 2
R58 57  96 0.50
R57 57  0 1.2K
C58  5  0 2.00P
G57  0 57 POLY(3) 3 0 4 0 35 0 0 312U 416U 833U
GD55 55 57 TABLE {V(55,57)} ((-2m,-1)(-1m,-1m)(0,0)(10,1n))
CD55 55 57 2p
CD56 57 56 2p
GD56 57 56 TABLE {V(57,56)} ((-2m,-1)(-1m,-1m)(0,0)(10,1n))
E55 55  0 POLY(2) 3 0 51 0 2M 1 -54M
E56 56  0 POLY(2) 4 0 52 0 1.2M 1 -50M
R51 51 0 1k
R52 52 0 1k
GD51 50 51 TABLE {V(50,51)} ((-10,-1n)(0,0)(1m,1m)(2m,1))
GD52 50 52 TABLE {V(50,52)}  ((-2m,-1)(-1m,-1m)(0,0)(10,1n))
CD51 50 52 2p
CD52 50 51 2p
G53  3  0 POLY(1) 51 0  -20.0U 1M
G54  0  4 POLY(1) 52 0  -20.0U -1M
*
* Current Limit
G99 96 5 99 0 1
R98 0 98 1 TC=-3.71M,8.17U
G97 0 98 TABLE { V(96,5) } ((-12.0,-7.00M)(-1.00M,-6.93M)(0,0)(1.00M,6.93M)(12.0,7.00M))
E97 99 0 VALUE { V(98)*((V(3)-V(4))*428M + 142M)}
D98 4 5 DESD
D99 5 3 DESD
*
* Temperature / Voltage Sensitive IQuiscent
R61 0 61 1 TC=2.24M,3.12U
G61 3 4 61 0 1
G60 0 61 TABLE {V(3,4)}
+ ((0,0)(800M,440N)(850M,3.00U)(1.3,40.0U)
+ (1.4,42.0U)(5.00,46.0U)(7.00,50.0U))
*
* Temperature Sensitive offset voltage
I73 0 70 DC 1uA
R74 0 70 1 TC=2.00
E75 1 71 70 0 1
*
* Temp Sensistive IBias
I62 0 62 DC 1uA
R62 0 62 REXP  1.1m
*
* Temp Sensistive Offset IBias
I63 0 63 DC 1uA
R63 0 63 1.1 TC=30.4M,454U
*
* Models
.MODEL NMI NMOS(L=2.00U W=50.0U KP=20.0U LEVEL=1 )
.MODEL DESD  D   N=1 IS=1.00E-15
.MODEL DN1 D   IS=1P KF=146E-18 AF=1
.MODEL REXP  RES TCE= 6.6
.ENDS MCP6401
*****
* (c) ON SEMICONDUCTOR
* Models developed and under copyright by:
* ON SEMICONDUCTOR
* ============================================================
* | Legal Notice: This material is intended for free
* | software support. The file may be copied and distributed.
* | However,reselling the material is illegal.
* ============================================================
* ============================================================
* | LM258, LM358, LM358A, LM2904, LM2904A, LM2904V, NCV2904
* |                  OP-AMP MACRO-MODEL
* |            Designed in pSpice Version 9.2
* |
* | The content of this model is subject to change
* | without notice and may not be modified or altered
* | without permission from ON Semiconductor. This model
* | has been carefully checked and is believed to be
* | accurate, however ON Semiconductor does not assume
* | liability for the use of this model or the results
* | obtained from using it.
* ============================================================
* ============================================================
* Features: - True Differential Input Stage
*           - Single Supply Operation: 3.0 V to 32 V
*           - Low Input Bias Currents
*           - Internally Compensated
*           - Common Mode Range Extends to Negative Supply
*           - Single and Split Supply Operation
* ============================================================
* $Author: Vallabh Chilakapati $
* $Date: 6 Aug 2006 $
* NOTE: - Noise is not modeled.
*       - Temperature is not modeled.
*       - PSR is not modeled.
*       - Model is for single device only.  Simulated supply current is 1/2 of
*         total package current.
* Connections:
*                   Non-Inverting Input
*                   |   Inverting Input
*                   |   |   +ve Voltage Supply
*                   |   |  |   -ve Voltage Supply
*                   |   |  |   |   Output
*                   |   |  |   |   |
.SUBCKT LM258_ON    1   2  11  12  24
***** Input Stage *****
Q_Q1            4 5 6           QPNP1
Q_Q2            7 8 9           QPNP2
I_I1            111 10          DC 1m
R_RC1           4 12            95.49
R_RC2           7 12            95.49
R_RE1           10 6            43.79
R_RE2           10 9            43.79
V_Vio           2 8             0Vdc
E_E4            1 5 16 14       1
E_EVcc          111 0 11 0      1
G_Vcc           0 11            poly(1)         11 0            0.556m 4.8u
***** Gain Stage & Frequency Response Stage *****
R_R3            13 12           1k
R_R4            111 13          100k
E_Eref          14 0 13 0       1
G_G1            14 15 7 4       0.01047
R_Rc            14 15           9.549Meg
C_Cc            14 15           1.667n
***** Output Stage *****
E_E1            22 14 15 14     1
V_F1            23 24           0
F_F1            11 0 V_F1       1
R_Rout          22 23           13
***** Common Mode Rejection *****
R_R1            3 1             1Meg
R_R2            2 3             1Meg
G_G2            14 16 3 14      5.6234n
R_Rcmr          17 16           10k
L_Lcmr          14 17           1.59H
***** Output Voltage Limiting *****
D_D1            15 18           D10D1
D_D2            19 15           D10D1
V_Voh           111 18          2.183
V_Vol           19 12           0.639
***** Output Current Limiting *****
D_D3            15 21           D10D1
D_D4            20 15           D10D1
V_V3            21 23           -0.207
V_V4            23 20           -0.467
.model QPNP1    PNP(Bf=10841.7)
.model QPNP2    PNP(Bf=11741.7)
.MODEL D10D1 D IS=6E-16 RS=1.000E-3 VJ=.75 BV=100E6
.ENDS
* OPA350 SPICE Macro-model              3/31/99, Rev. B   by Marek Lis
* Rev. A  12/18/98,  by Marek Lis
* REV. B  23 DEC 1998 NEIL ALBAUGH; REVISED CONNECTION NAMES TO MATCH SYMBOL
* Rev. C  3/31/99,  by Marek Lis: added voltage and current noise (1/f noise is NOT modeled.)
* REV. D  1 APR 1999 NEIL ALBAUGH; REVISED CONNECTION NAMES TO MATCH SYMBOL
*
*
*
*
*
* Copyright 1997 by Burr-Brown Corporation
*
*                non-inverting input
*                |  inverting input
*                |  |  positive supply
*                |  |  |   negative supply
*                |  |  |   |   output
*                |  |  |   |   |
.SUBCKT OPA350   +  -  V+  V-  OUT
* INPUT STAGE
*
i1 V+ 5 400u
m7 550 vswitch 5 5 pix l=2u w=25u m=26
m8 550 550 V- V- nix l=2u w=25u m=26
m9 553a 550 V- V- nix l=2u w=25u m=26
m9c 66 nvsat 553a V- nix l=2u w=25u m=26
Vpvsat V+ vswitch DC 1.8
Vnvsat nvsat V- DC 1.37
iin1 + 98 .5p
iin2 - 98 .5p
d3 5 V+ dx
d4 V- 66 dx
d5 - V+ dx
d6 + V+ dx
d7 V- - dx
d8 V- + dx
rinp 7 7a 500
rinn - 2a 500
m1 33 2a 66 V- nix l=2u w=25u m=13
m2 4 7a 66 V- nix l=2u w=25u m=13
m3 8 2a 5 5 pix l=2u w=25u m=13
m4 9 7a 5 5 pix l=2u w=25u m=13
eos 7 + poly(1) 25 98 0 0
ios - + 0p
r1 V+ 33x 4.833k
r2 V+ 4x 4.833k
r3 8x V- 4.833k
r4 9x V- 4.833k
vr1 33 33x DC 2
vr2 4 4x DC 2
vr3 8x 8 DC 2
vr4 9x 9 DC 2
i1a V+ V- 2464u
*
* GAIN STAGE
*
eref 98 0 poly(2) V+ 0 V- 0 0 0.5 0.5
g1 98 21 poly(2) 4 33 9 8 0 145u 145u
rg 21 98 2.3e6
cc 21 6c 10.6pF
rcc 6c OUT 2.4k
d1 21 22 dx
d2 23 21 dx
v1 V+ 22 1.37
v2 23 V- 1.37
*
* COMMON MODE GAIN STAGE
*
ecm 24 98 poly(2) + 98 - 98 0 0.5 0.5
r5 24 25 1e6
r6 25 98 10k
c1 24 25 0.75p
*
* OUTPUT STAGE
*
isy V+ V- 540.4u
gsy V+ V- poly(1) V+ V- -3.334e-4 6.667e-5
ep V+ 39 poly(1) 98 21 0.78925 1
en 38 V- poly(1) 21 98 0.78925 1
vh OUT 6h DC -2.4e-2
vl 6l OUT DC -2.4e-2
m113 6h 39 V+ V+ pox l=1.5u w=1500u m=12
m114 6l 38 V- V- nox l=1.5u w=1500u m=12
c15 OUT 39 15p
c16 OUT 38 15p
.model dx d(rs=1 cjo=0.1p)
.model nix nmos(vto=0.75 kp=205.5u rd=1 rs=1 rg=1 rb=1 cgso=4e-9
+cgdo=4e-9 cgbo=16.667e-9 cbs=2.34e-13 cbd=2.34e-13)
.model nox nmos(vto=0.75 kp=195u rd=.5 rs=.5 rg=1 rb=1 cgso=66.667e-12
+cgdo=66.667e-12 cgbo=125e-9 cbs=2.34e-13 cbd=2.34e-13)
.model pix pmos(vto=-0.75 kp=205.5u rd=1 rs=1 rg=1 rb=1 cgso=4e-9
+cgdo=4e-9 cgbo=16.667e-9 cbs=2.34e-13 cbd=2.34e-13)
.model pox pmos(vto=-0.75 kp=195u rd=.5 rs=.5 rg=1 rb=1 cgso=66.667e-12
+cgdo=66.667e-12 cgbo=125e-9 cbs=2.34e-13 cbd=2.34e-13)
.ENDS OPA350
* OPA2340
*****************************************************************************
* (C) Copyright 2011 Texas Instruments Incorporated. All rights reserved.
*****************************************************************************
** This model is designed as an aid for customers of Texas Instruments.
** TI and its licensors and suppliers make no warranties, either expressed
** or implied, with respect to this model, including the warranties of
** merchantability or fitness for a particular purpose.  The model is
** provided solely on an "as is" basis.  The entire risk as to its quality
** and performance is with the customer.
*****************************************************************************
*
* This model is subject to change without notice. Texas Instruments
* Incorporated is not responsible for updating this model.
*
*****************************************************************************
*
** Released by: Analog eLab Design Center, Texas Instruments Inc.
* Part: OPA2340
* Date: 31MAY2011
* Model Type: ALL IN ONE
* Simulator: PSPICE
* Simulator Version: 16.0.0.p.001
* EVM Order Number: N/A
* EVM Users Guide: N/A
* Datasheet: SBOS073B?SEPTEMBER 1997?REVISED NOVEMBER 2007
*
* Model Version: 1.0
*
*****************************************************************************
*
* Updates:
*
* Version 1.0 :
* Release to Web
*
*****************************************************************************
*
* THIS MODEL IS APPLICABLE TO OPA340, OPA2340, OPA4340
*                non-inverting input
*                |  inverting input
*                |  |  positive supply
*                |  |  |   negative supply
*                |  |  |   |   output
*                |  |  |   |   |
.SUBCKT OPA2340   +  -  V+  V-  OUT
* INPUT STAGE
*
i1 V+ 5 150u
m7 550 vswitch 5 5 pix l=6u w=25u m=4
m8 550 550 V- V- nix l=6u w=25u m=4
m9 553a 550 V- V- nix l=6u w=25u m=4
m9c 66 nvsat 553a V- nix l=6u w=25u m=4
Vpvsat V+ vswitch DC 1.3
Vnvsat nvsat V- DC 1.37
iin1 + 98 .2p
iin2 - 98 .2p
d3 5 V+ dx
d4 V- 66 dx
d5 - V+ dx
d6 + V+ dx
d7 V- - dx
d8 V- + dx
m1 33 - 66 V- nix l=6u w=25u
m2 4 7 66 V- nix l=6u w=25u
m3 8 - 5 5 pix l=6u w=25u
m4 9 7 5 5 pix l=6u w=25u
eos 7 + poly(1) 25 98 0 0
ios - + 0p
r1 V+ 33 4.833k
r2 V+ 4 4.833k
r3 8 V- 4.833k
r4 9 V- 4.833k
*
* GAIN STAGE
*
eref 98 0 poly(2) V+ 0 V- 0 0 0.5 0.5
g1 98 21 poly(2) 4 33 9 8 0 145u 145u
rg 21 98 18.078e6
cc 21 OUT 10.5p
d1 21 22 dx
d2 23 21 dx
v1 V+ 22 1.37
v2 23 V- 1.37
*
* COMMON MODE GAIN STAGE
*
ecm 24 98 poly(2) + 98 - 98 0 0.5 0.5
r5 24 25 1e6
r6 25 98 10k
c1 24 25 0.75p
*
* OUTPUT STAGE
*
isy V+ V- 450.4u
gsy V+ V- poly(1) V+ V- -3.334e-4 6.667e-5
ep V+ 39 poly(1) 98 21 0.78925 1
en 38 V- poly(1) 21 98 0.78925 1
vh OUT 6h DC 1e-2
vl 6l OUT DC 1e-2
m113 6h 39 V+ V+ pox l=1.5u w=1500u
m114 6l 38 V- V- nox l=1.5u w=1500u
c15 OUT 39 50p
c16 OUT 38 50p
.model dx d(rs=1 cjo=0.1p)
.model nix nmos(vto=0.75 kp=205.5u rd=1 rs=1 rg=1 rb=1 cgso=4e-9
+cgdo=4e-9 cgbo=16.667e-9 cbs=2.34e-13 cbd=2.34e-13)
.model nox nmos(vto=0.75 kp=195u rd=.5 rs=.5 rg=1 rb=1 cgso=66.667e-12
+cgdo=66.667e-12 cgbo=125e-9 cbs=2.34e-13 cbd=2.34e-13)
.model pix pmos(vto=-0.75 kp=205.5u rd=1 rs=1 rg=1 rb=1 cgso=4e-9
+cgdo=4e-9 cgbo=16.667e-9 cbs=2.34e-13 cbd=2.34e-13)
.model pox pmos(vto=-0.75 kp=195u rd=.5 rs=.5 rg=1 rb=1 cgso=66.667e-12
+cgdo=66.667e-12 cgbo=125e-9 cbs=2.34e-13 cbd=2.34e-13)
.ENDS OPA2340
.tran 20m startup
.lib IL300.sub
.backanno
.end